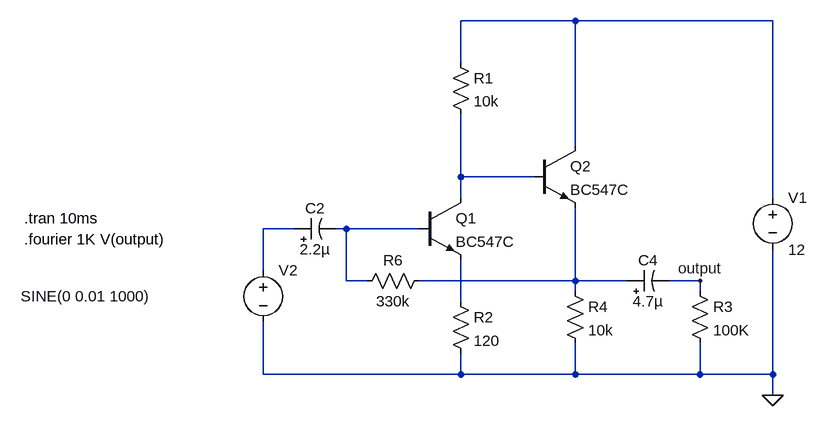
[diagram p0: schematic electret_mic_preamp_bc547.asc]
electret_mic_preamp_bc547.asc, the LTspice schematic file:
Version 4
SHEET 1 1344 680
WIRE 384 -160 208 -160
WIRE 688 -160 384 -160
WIRE 208 -96 208 -160
WIRE 384 32 384 -160
WIRE 208 80 208 -16
WIRE 320 80 208 80
WIRE 208 112 208 80
WIRE 688 112 688 -160
WIRE -48 160 -96 160
WIRE 32 160 16 160
WIRE 144 160 32 160
WIRE -96 224 -96 160
WIRE 32 240 32 160
WIRE 64 240 32 240
WIRE 384 240 384 128
WIRE 384 240 144 240
WIRE 464 240 384 240
WIRE 576 240 528 240
WIRE 384 256 384 240
WIRE 576 256 576 240
WIRE 208 272 208 208
WIRE -96 384 -96 304
WIRE 208 384 208 352
WIRE 208 384 -96 384
WIRE 384 384 384 336
WIRE 384 384 208 384
WIRE 576 384 576 336
WIRE 576 384 384 384
WIRE 688 384 688 192
WIRE 688 384 576 384
WIRE 688 416 688 384
FLAG 688 416 0
FLAG 576 240 output
SYMBOL npn 144 112 R0
SYMATTR InstName Q1
SYMATTR Value BC547C
SYMBOL npn 320 32 R0
SYMATTR InstName Q2
SYMATTR Value BC547C
SYMBOL voltage 688 96 R0
WINDOW 123 0 0 Left 0
WINDOW 39 0 0 Left 0
SYMATTR InstName V1
SYMATTR Value 12
SYMBOL res 192 -112 R0
SYMATTR InstName R1
SYMATTR Value 10k
SYMBOL res 368 240 R0
SYMATTR InstName R4
SYMATTR Value 10k
SYMBOL polcap -48 176 R270
WINDOW 0 32 32 VTop 2
WINDOW 3 0 32 VBottom 2
SYMATTR InstName C2
SYMATTR Value 2.2µ
SYMATTR Description Capacitor
SYMATTR Type cap
SYMATTR SpiceLine V=100 Irms=22m Rser=9.8 Lser=0
SYMBOL voltage -96 208 R0
WINDOW 3 -373 56 Left 2
WINDOW 123 0 0 Left 0
WINDOW 39 0 0 Left 0
SYMATTR Value SINE(0 0.01 1000)
SYMATTR InstName V2
SYMBOL res 160 224 R90
WINDOW 0 0 56 VBottom 2
WINDOW 3 32 56 VTop 2
SYMATTR InstName R6
SYMATTR Value 330k
SYMBOL polcap 464 256 R270
WINDOW 0 32 32 VTop 2
WINDOW 3 0 32 VBottom 2
SYMATTR InstName C4
SYMATTR Value 4.7µ
SYMATTR Description Capacitor
SYMATTR Type cap
SYMBOL res 560 240 R0
SYMATTR InstName R3
SYMATTR Value 100K
SYMBOL res 192 256 R0
SYMATTR InstName R2
SYMATTR Value 120
TEXT -464 144 Left 2 !.tran 10ms
TEXT -464 176 Left 2 !.fourier 1K V(output)

The netlist it stands for:
* electret_mic_preamp_bc547.asc
Q1 N002 N004 N006 0 BC547C
Q2 N001 N002 N005 0 BC547C
V1 N001 0 12
R1 N001 N002 10k
R4 N005 0 10k
C2 N003 N004 2.2µ V=100 Irms=22m Rser=9.8 Lser=0
V2 N003 0 SINE(0 0.01 1000)
R6 N005 N004 330k
C4 N005 output 4.7µ
R3 output 0 100K
R2 N006 0 120
.model NPN NPN
.model PNP PNP
.lib standard.bjt
.tran 10ms
.fourier 1K V(output)
.backanno
.end